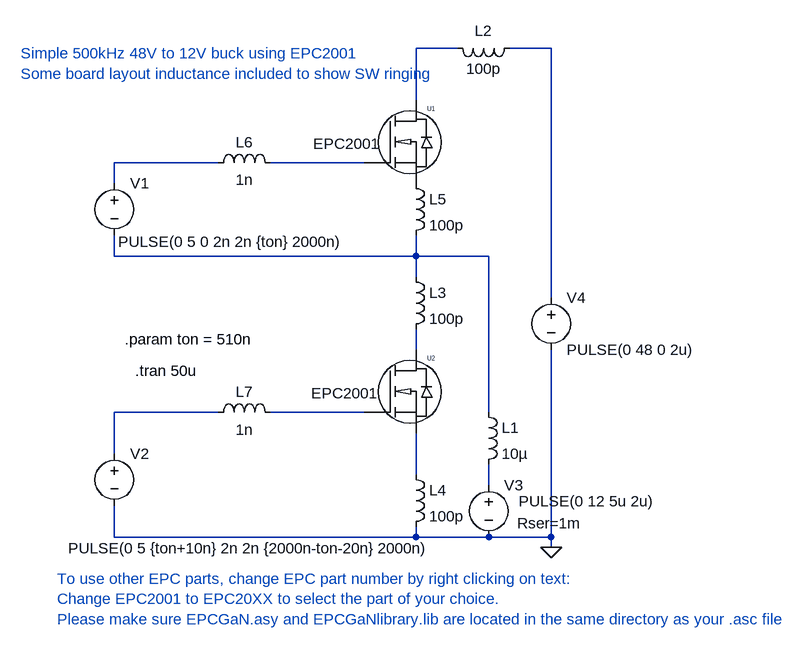
[diagram p0: schematic Example EPC2001.asc]
Example EPC2001.asc, the LTspice schematic file:
Version 4
SHEET 1 2008 680
WIRE 1280 -688 1216 -688
WIRE 1424 -688 1360 -688
WIRE 1216 -608 1216 -688
WIRE 912 -512 752 -512
WIRE 1136 -512 992 -512
WIRE 752 -480 752 -512
WIRE 752 -368 752 -400
WIRE 1216 -368 1216 -400
WIRE 1216 -368 752 -368
WIRE 1328 -368 1216 -368
WIRE 1216 -336 1216 -368
WIRE 1424 -304 1424 -688
WIRE 1216 -224 1216 -256
WIRE 912 -128 752 -128
WIRE 1136 -128 992 -128
WIRE 1328 -128 1328 -368
WIRE 752 -64 752 -128
WIRE 1216 -32 1216 -96
WIRE 1328 -16 1328 -48
WIRE 752 64 752 16
WIRE 1216 64 1216 48
WIRE 1216 64 752 64
WIRE 1328 64 1216 64
WIRE 1424 64 1424 -224
WIRE 1424 64 1328 64
WIRE 1424 80 1424 64
FLAG 1424 80 0
SYMBOL voltage 752 -496 R0
WINDOW 3 6 106 Left 2
WINDOW 123 0 0 Left 2
SYMATTR Value PULSE(0 5 0 2n 2n {ton} 2000n)
SYMATTR SpiceLine Rser=2
SYMATTR InstName V1
SYMBOL voltage 1424 -320 R0
WINDOW 123 0 0 Left 2
SYMATTR SpiceLine Rser=2m
SYMATTR InstName V4
SYMATTR Value PULSE(0 48 0 2u)
SYMBOL ind 1312 -144 R0
SYMATTR InstName L1
SYMATTR Value 10µ
SYMATTR SpiceLine Rser=15m
SYMBOL voltage 1328 -32 R0
WINDOW 123 0 0 Left 2
WINDOW 39 44 75 Left 2
WINDOW 3 46 41 Left 2
SYMATTR SpiceLine Rser=1m
SYMATTR Value PULSE(0 12 5u 2u)
SYMATTR InstName V3
SYMBOL EPCGaN 1136 -128 R0
WINDOW 3 -81 -29 Left 2
SYMATTR Value EPC2001
SYMATTR InstName U2
SYMBOL EPCGaN 1136 -512 R0
WINDOW 3 -78 -29 Left 2
SYMATTR Value EPC2001
SYMATTR InstName U1
SYMBOL voltage 752 -80 R0
WINDOW 3 -71 161 Left 2
WINDOW 123 0 0 Left 2
SYMATTR Value PULSE(0 5 {ton+10n} 2n 2n {2000n-ton-20n} 2000n)
SYMATTR SpiceLine Rser=2
SYMATTR InstName V2
SYMBOL ind 1376 -704 R90
WINDOW 0 5 56 VBottom 2
WINDOW 3 32 56 VTop 2
SYMATTR InstName L2
SYMATTR Value 100p
SYMATTR SpiceLine Rpar=10
SYMBOL ind 1200 -352 R0
SYMATTR InstName L3
SYMATTR Value 100p
SYMATTR SpiceLine Rpar=10
SYMBOL ind 896 -496 R270
WINDOW 0 32 56 VTop 2
WINDOW 3 5 56 VBottom 2
SYMATTR InstName L6
SYMATTR Value 1n
SYMATTR SpiceLine Rser=1 Rpar=10
SYMBOL ind 896 -112 R270
WINDOW 0 32 56 VTop 2
WINDOW 3 5 56 VBottom 2
SYMATTR InstName L7
SYMATTR Value 1n
SYMATTR SpiceLine Rser=1 Rpar=10
SYMBOL ind 1200 -48 R0
SYMATTR InstName L4
SYMATTR Value 100p
SYMATTR SpiceLine Rpar=10
SYMBOL ind 1200 -496 R0
SYMATTR InstName L5
SYMATTR Value 100p
SYMATTR SpiceLine Rpar=10
TEXT 784 -192 Left 2 !.tran 50u
TEXT 608 -680 Left 2 ;Simple 500kHz 48V to 12V buck using EPC2001\nSome board layout inductance included to show SW ringing
TEXT 664 128 Left 2 ;To use other EPC parts, change EPC part number by right clicking on text:\nChange EPC2001 to EPC20XX to select the part of your choice.\nPlease make sure EPCGaN.asy and EPCGaNlibrary.lib are located in the same directory as your .asc file
TEXT 768 -240 Left 2 !.param ton = 510n

The netlist it stands for:
* Example EPC2001.asc
V1 N003 N005 PULSE(0 5 0 2n 2n {ton} 2000n) Rser=2
V4 N002 0 PULSE(0 48 0 2u) Rser=2m
L1 N005 N010 10µ Rser=15m
V3 N010 0 PULSE(0 12 5u 2u) Rser=1m
XU2 N008 N006 N009 EPC2001  ; pins gatein drainin N_0
XU1 N004 N001 P001 EPC2001  ; pins gatein drainin N_0
V2 N007 0 PULSE(0 5 {ton+10n} 2n 2n {2000n-ton-20n} 2000n) Rser=2
L2 N002 N001 100p Rpar=10
L3 N005 N006 100p Rpar=10
L6 N003 N004 1n Rser=1 Rpar=10
L7 N007 N008 1n Rser=1 Rpar=10
L4 N009 0 100p Rpar=10
L5 P001 N005 100p Rpar=10
.tran 50u
* Simple 500kHz 48V to 12V buck using EPC2001
* Some board layout inductance included to show SW ringing
* To use other EPC parts, change EPC part number by right clicking on text:
* Change EPC2001 to EPC20XX to select the part of your choice.
* Please make sure EPCGaN.asy and EPCGaNlibrary.lib are located in the same directory as your .asc file
.param ton = 510n
.lib EPCGanlibrary.lib
.backanno
.end